# EAGLE design dumper (EAGLE 9.2.2)
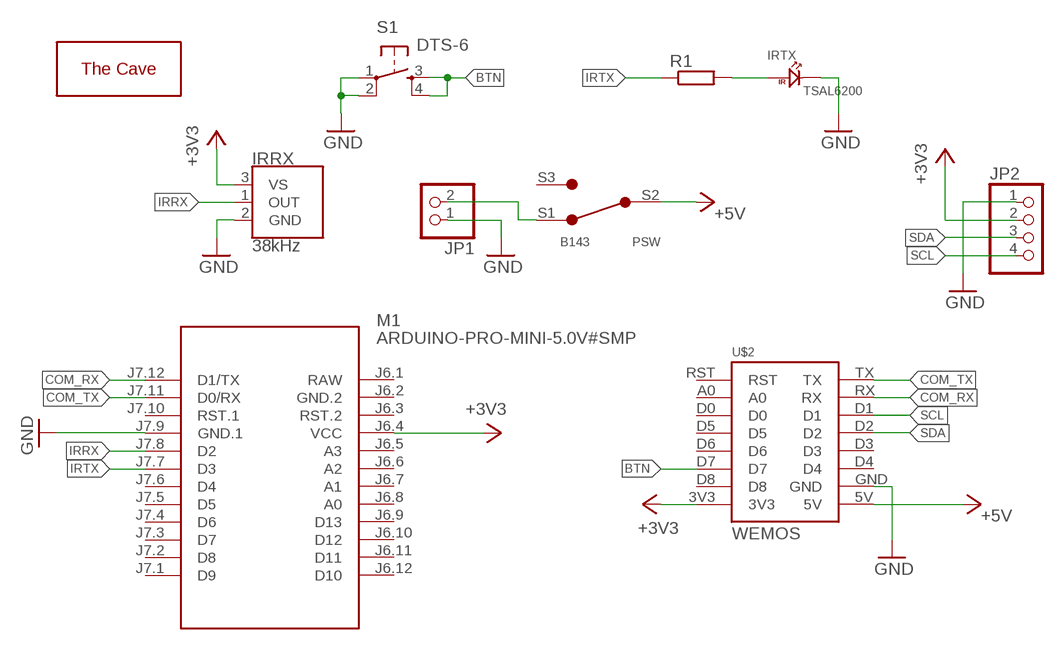
[diagram p0: schematic, sheet 1]

## Parts
IRRX  38kHz  TSOP38238  [TSOP382]
IRTX  TSAL6200  [TSAL6200]
JP1  PINHD-1X2  [1X02]
JP2  PINHD-1X4  [1X04]
M1  ARDUINO-PRO-MINI-5.0V#SMP  [ARDUINO-PRO-MINI#SMP]
PSW  B143  [B143]
R1  R-EU_0207/7  [0207/7]
S1  DTS-6  [DTS-6]
U$1  THECAVE_LOGO_NEW_TOP_SMALL  [NEW_LOGO_SMALL_TOP]
U$2  WEMOS  [WEMOS]

## Nets
+3V3: IRRX.3(VS) JP2.2 M1.J6.4(VCC) U$2.3V3
+5V: PSW.S2(COM) U$2.5V
BTN: S1.3 S1.4 U$2.D7
COM_RX: M1.J7.12(D1/TX) U$2.RX
COM_TX: M1.J7.11(D0/RX) U$2.TX
GND: IRRX.2(GND) IRTX.N JP1.1 JP2.1 M1.J7.9(GND.1) S1.1 S1.2 U$2.GND
IRRX: IRRX.1(OUT) M1.J7.8(D2)
IRTX: M1.J7.7(D3) R1.1
N$1: JP1.2 PSW.S1
N$2: IRTX.P R1.2
SCL: JP2.4 U$2.D1
SDA: JP2.3 U$2.D2
Unconnected: M1.J6.3(RST.2) M1.J6.5(A3) M1.J6.6(A2) M1.J6.7(A1) M1.J6.8(A0) M1.J6.9(D13) M1.J6.10(D12) M1.J6.11(D11) M1.J6.12(D10) M1.J7.1(D9) M1.J7.2(D8) M1.J7.3(D7) M1.J7.4(D6) M1.J7.5(D5) M1.J7.6(D4) M1.J7.10(RST.1) PSW.S3(S2) U$2.A0 U$2.D0 U$2.D3 U$2.D4 U$2.D5 U$2.D6 U$2.D8 U$2.RST

## Power pins joined to a net without a drawn wire
GND.2: M1.J6.2(GND.2)
RAW: M1.J6.1(RAW)

## Library data of the parts
IRRX = SparkFun-Sensors:TSOP382: Vishay Semiconductor TSOP32838 - 38kHz IR Receiver These products are miniaturized IR receiver modules for infrared remote control systems. A PIN diode and a preamplifier are assembled on a leadframe, the epoxy package contains an IR filter. The demodulated output signal can be directly connected to a microprocessor for decoding.; PROD_ID: SEN-10266
IRTX = Seeed-OPL-2017-01-Sensor-camilo:TSAL6200: 314020023
JP1 = pinhead:PINHD-1X2: PIN HEADER
JP2 = pinhead:PINHD-1X4: PIN HEADER
M1 = diy-modules:ARDUINO-PRO-MINI-*#SMP: Arduino Pro Mini (and compatible devices) with 2 connectors only More details available here: https://www.arduino.cc/en/Main/ArduinoBoardProMini Click here to find device on ebay.com <http://www.ebay.com/sch/arduino+pro+mini>
PSW = thecave:B143: One pole slide switch, through hole mount https://www.gme.cz/p-b143-1 https://www.gme.cz/b143
R1 = rcl:R-EU_: RESISTOR, European symbol; SPICEPREFIX: R
S1 = switch-tact:DTS-6
U$1 = thecave:THECAVE_LOGO: The Cave DIY workshop logos thecave.cz
U$2 = d1-mini:WEMOS

## Board
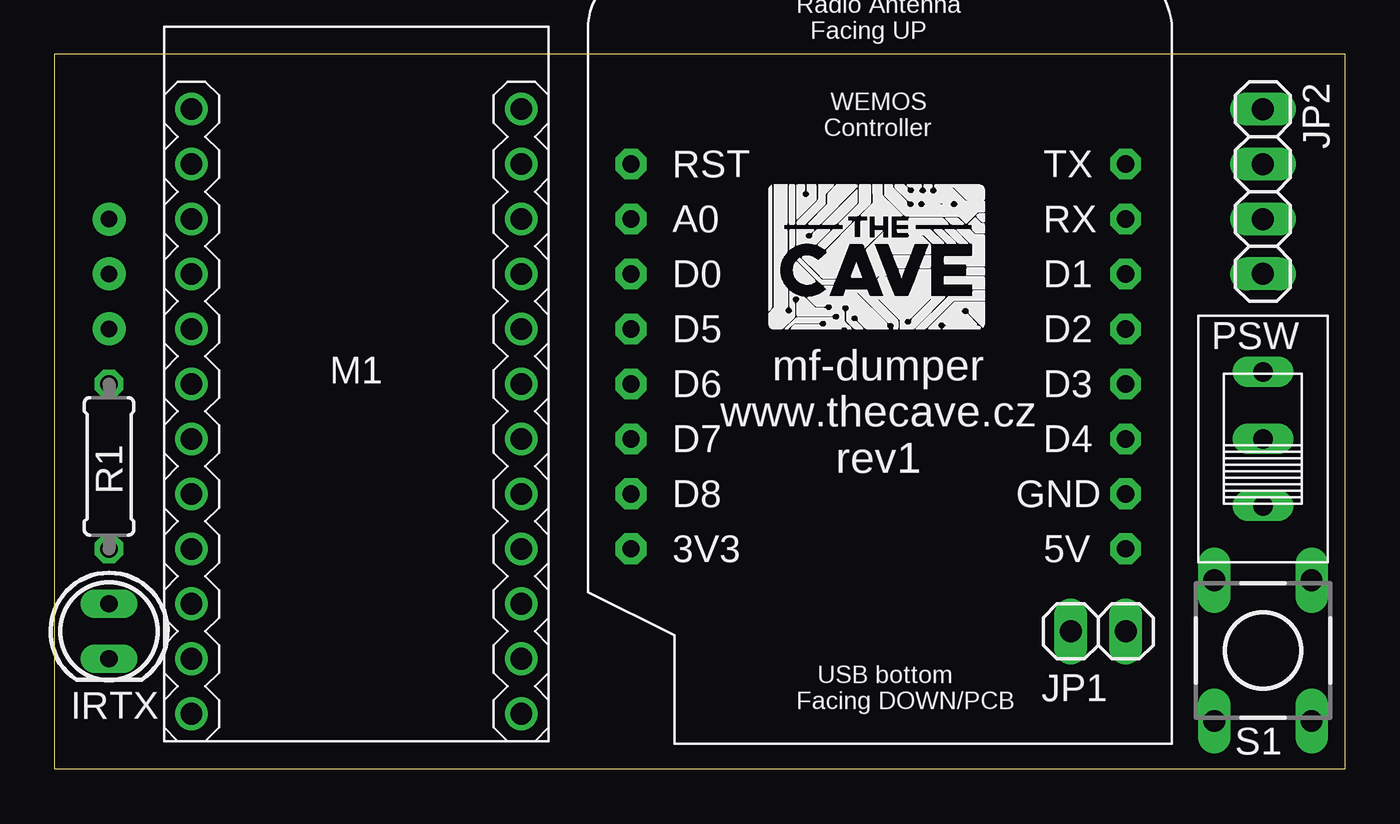
[diagram p1: board, top side]
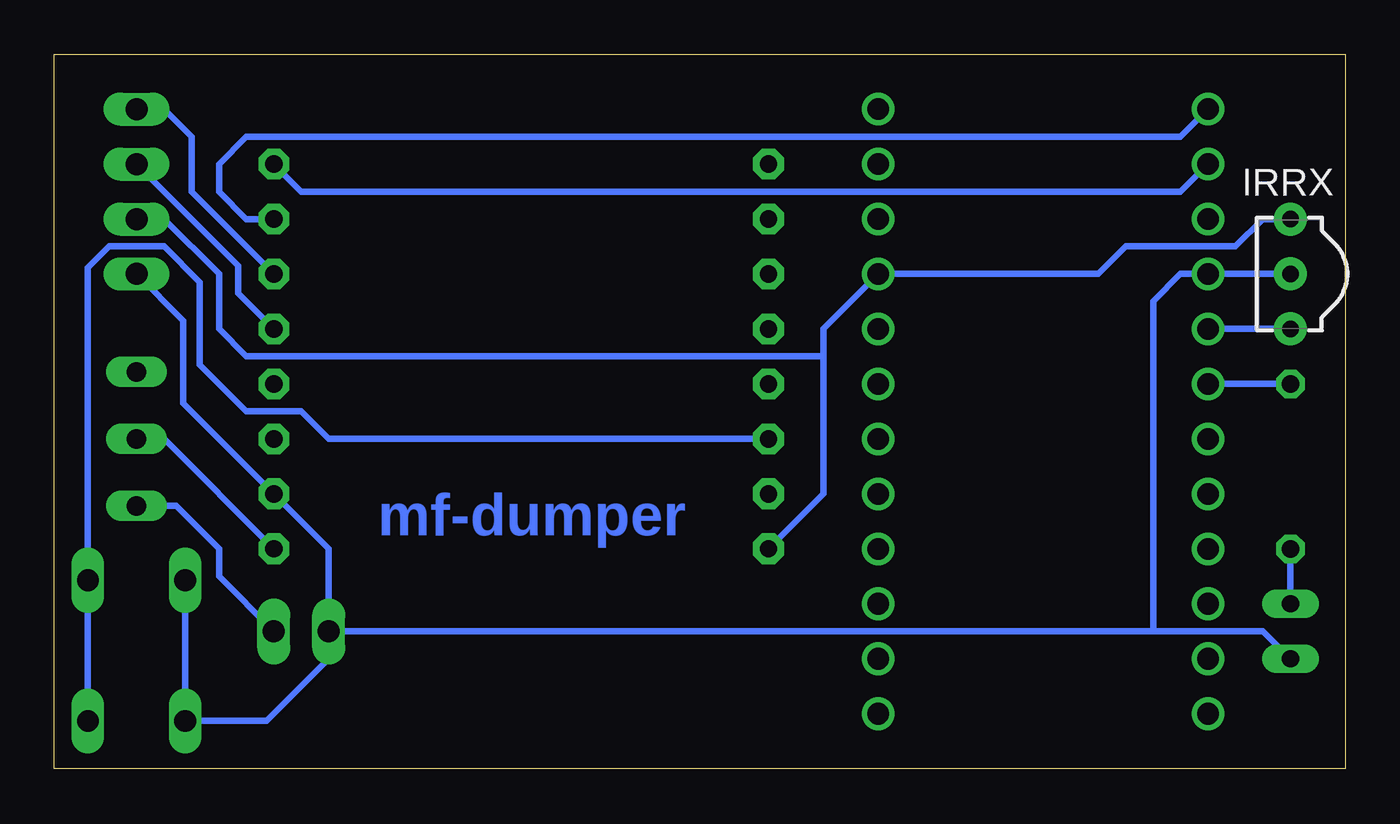
[diagram p2: board, bottom side, seen from below]

Size 59.69 x 33.02 mm. Coordinates in mm from the lower left corner, seen from the top.
Outline: 0,0 59.69,0 59.69,33.02 0,33.02 0,0
Copper layers (1*16): Top 0.035mm / dielectric 1.5mm / Bottom 0.035mm
Design rules "default *": minimum track width 10mil, minimum drill 0.35mm, track to track 10mil, track to pad 10mil, pad to pad 10mil, via to via 10mil, smd to smd 10mil, copper to edge 24mil, drill to drill 10mil, minimum pad ring 10mil, minimum via ring 8mil, stop-mask expansion 4mil, vias tented up to drill 0mil, thermal gap 10mil

### Footprints (pad centres in the part's own frame; a part is rotated, then mirrored left to right if it is on the bottom)
TSOP382 = drill 0.762 pad 1.524: 1 -2.54,0; 2 0,0; 3 2.54,0
TSAL6200 = drill 0.8 long: N 1.27,0; P -1.27,0
1X02 = drill 1.016 long: 1 -1.27,0; 2 1.27,0
1X04 = drill 1.016 long: 1 -3.81,0; 2 -1.27,0; 3 1.27,0; 4 3.81,0
ARDUINO-PRO-MINI#SMP = drill 1: J6.1 -12.7,7.62; J6.2 -10.16,7.62; J6.3 -7.62,7.62; J6.4 -5.08,7.62; J6.5 -2.54,7.62; J6.6 0,7.62; J6.7 2.54,7.62; J6.8 5.08,7.62; J6.9 7.62,7.62; J6.10 10.16,7.62; J6.11 12.7,7.62; J6.12 15.24,7.62; J7.1 15.24,-7.62; J7.2 12.7,-7.62; J7.3 10.16,-7.62; J7.4 7.62,-7.62; J7.5 5.08,-7.62; J7.6 2.54,-7.62; J7.7 0,-7.62; J7.8 -2.54,-7.62; J7.9 -5.08,-7.62; J7.10 -7.62,-7.62; J7.11 -10.16,-7.62; J7.12 -12.7,-7.62
B143 = drill 0.9 long: S1 -3.1,0; S2 0,0; S3 3.1,0
0207/7 = drill 0.813 octagon: 1 -3.81,0; 2 3.81,0
DTS-6 = drill 1 long: 1 -3.25,2.25; 2 3.25,2.25; 3 -3.25,-2.25; 4 3.25,-2.25
WEMOS = drill 0.8 pad 1.422 octagon: 3V3 0,0; 5V 22.86,0; A0 0,15.24; D0 0,12.7; D1 22.86,12.7; D2 22.86,10.16; D3 22.86,7.62; D4 22.86,5.08; D5 0,10.16; D6 0,7.62; D7 0,5.08; D8 0,2.54; GND 22.86,2.54; RST 0,17.78; RX 22.86,15.24; TX 22.86,17.78

### Placement (x,y rotation side)
IRRX  2.54,22.86 90 bottom
IRTX  2.54,6.35 270 top
JP1  48.26,6.35 0 top
JP2  55.88,26.67 90 top
M1  13.97,17.78 270 top
PSW  55.88,15.24 90 top
R1  2.54,13.97 270 top
S1  55.88,5.46 90 top
U$1  33.02,20.32 0 top
U$2  26.67,10.16 0 top

### Tracks (layer width: path | path; a pad name or v marks a point on that pad's centre or on a via)
+3V3
  Bottom 0.305: IRRX.3 3.81,25.4 5.08,24.13 10.16,24.13 11.43,22.86 M1.J6.4 24.13,20.32 24.13,19.05 | 24.13,19.05 24.13,12.7 U$2.3V3 | JP2.2 54.61,25.4 52.07,22.86 52.07,20.32 50.8,19.05 24.13,19.05
+5V
  Bottom 0.305: U$2.5V 54.61,15.24 PSW.S2
BTN
  Bottom 0.305: S1.3 S1.4 58.13,23.15 57.15,24.13 54.61,24.13 52.96,22.48 52.96,18.67 50.8,16.51 48.26,16.51 46.99,15.24 U$2.D7
COM_RX
  Bottom 0.305: M1.J7.12 7.62,29.21 50.8,29.21 52.07,27.94 52.07,26.67 50.8,25.4 U$2.RX
COM_TX
  Bottom 0.305: M1.J7.11 7.62,26.67 48.26,26.67 U$2.TX
GND
  Bottom 0.305: IRRX.2 M1.J7.9 7.62,22.86 8.89,21.59 8.89,6.35 | IRTX.N 3.81,6.35 8.89,6.35 | 8.89,6.35 JP1.1 | JP1.1 46.99,10.16 U$2.GND 53.72,16.89 53.72,20.7 JP2.1 | S1.2 S1.1 49.86,2.21 46.99,5.08 JP1.1
IRRX
  Bottom 0.305: IRRX.1 M1.J7.8
IRTX
  Bottom 0.305: M1.J7.7 R1.1
N$1
  Bottom 0.305: JP1.2 52.07,8.89 52.07,10.16 54.05,12.14 PSW.S1
N$2
  Bottom 0.305: R1.2 IRTX.P
SCL
  Bottom 0.305: U$2.D1 53.34,26.67 53.34,29.21 54.61,30.48 JP2.4
SDA
  Bottom 0.305: U$2.D2 51.18,21.97 51.18,23.24 JP2.3

### Text on the board
Bottom: mf-dumper
tPlace: mf-dumper / www.thecave.cz / rev1